# Altium schematic sheet Shift Reg.SchDoc
size A4
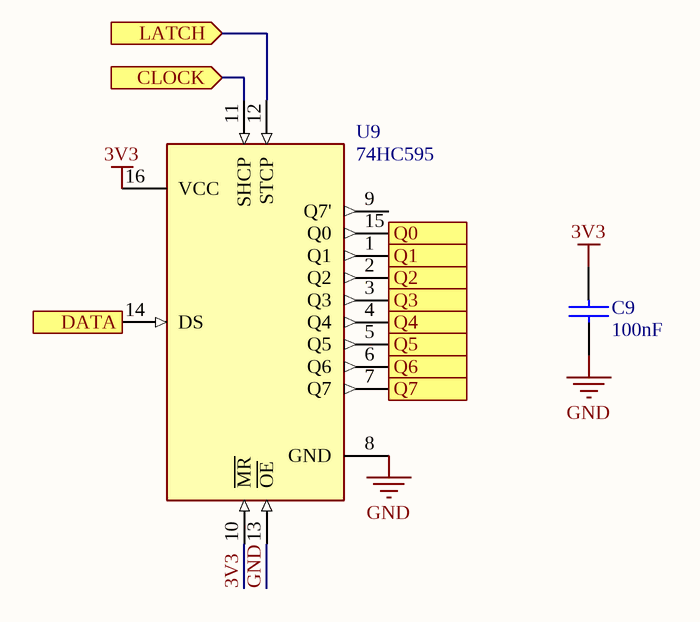
[diagram p0: Shift Reg.SchDoc]

## Parts
C9  100nF  [0805]
U9  74HC595  [SOIC16N]

## Ports
CLOCK (in), DATA (in), LATCH (in), Q0 (out), Q1 (out), Q2 (out), Q3 (out), Q4 (out), Q5 (out), Q6 (out), Q7 (out)

## Nets
3V3: C9.1 U9.10(~{MR}) U9.16(VCC)
GND: C9.2 U9.8(GND) U9.13(~{OE})
CLOCK: U9.11(SHCP) ; port CLOCK
DATA: U9.14(DS) ; port DATA
LATCH: U9.12(STCP) ; port LATCH
Q0: U9.15(Q0) ; port Q0
Q1: U9.1(Q1) ; port Q1
Q2: U9.2(Q2) ; port Q2
Q3: U9.3(Q3) ; port Q3
Q4: U9.4(Q4) ; port Q4
Q5: U9.5(Q5) ; port Q5
Q6: U9.6(Q6) ; port Q6
Q7: U9.7(Q7) ; port Q7

Not connected (* = marked no-connect by the designer): U9 9(Q7')

## Library data of the parts
C9 = CAP